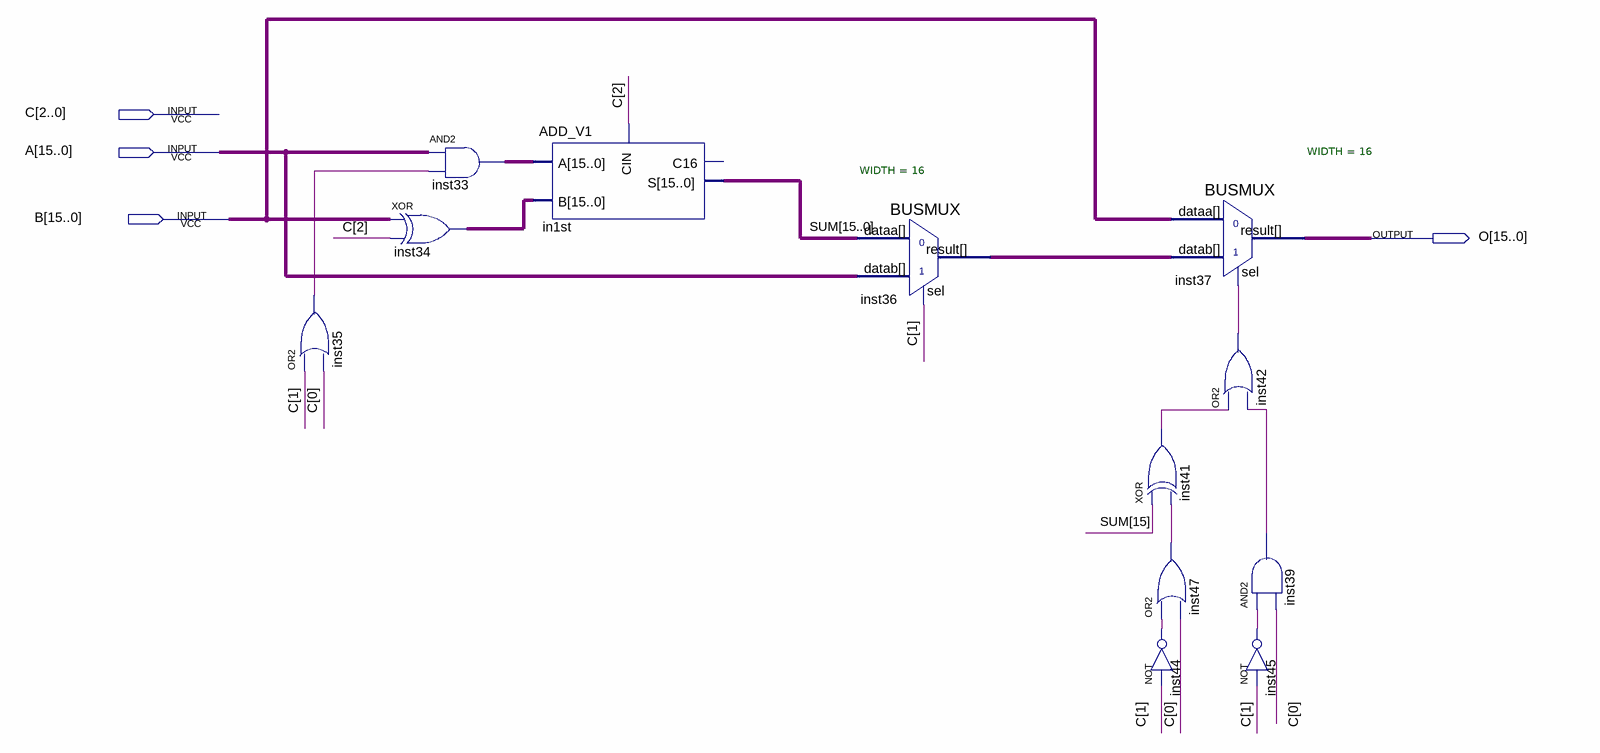
[diagram p0: schematic sheet]
// Quartus schematic ABSMINMAXADDSUB.bdf as structural Verilog: 12 symbols, 4 pins
module ABSMINMAXADDSUB (
  input  [2:0] C,
  input  [15:0] A,
  input  [15:0] B,
  output [15:0] O
);

  wire inst35_out, inst39_out, inst41_out, inst42_out, inst44_out, inst45_out, inst47_out;
  wire [15:0] inst33_out, inst34_out, inst36_result, SUM;

  or inst35 (inst35_out, C[1], C[0]);
  assign inst34_out = B ^ {16{C[2]}};  // XOR inst34, 16 bits wide
  assign inst33_out = A & {16{inst35_out}};  // AND2 inst33, 16 bits wide
  ADD_V1 in1st (.A(inst33_out), .B(inst34_out), .CIN(C[2]), .S(SUM));  // open: C16
  BUSMUX #(.WIDTH(16)) inst36 (.datab(A), .sel(C[1]), .dataa(SUM), .result(inst36_result));
  BUSMUX #(.WIDTH(16)) inst37 (.datab(inst36_result), .sel(inst42_out), .dataa(B), .result(O));
  xor inst41 (inst41_out, SUM[15], inst47_out);
  or inst47 (inst47_out, inst44_out, C[0]);
  not inst44 (inst44_out, C[1]);
  or inst42 (inst42_out, inst41_out, inst39_out);
  and inst39 (inst39_out, inst45_out, C[0]);
  not inst45 (inst45_out, C[1]);
endmodule
